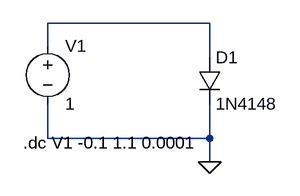
[diagram p0: schematic d1n4148_ref.asc]
d1n4148_ref.asc, the LTspice schematic file:
Version 4
SHEET 1 880 680
WIRE 256 48 32 48
WIRE 32 80 32 48
WIRE 256 96 256 48
WIRE 32 208 32 160
WIRE 256 208 256 160
WIRE 256 208 32 208
WIRE 256 240 256 208
FLAG 256 240 0
SYMBOL diode 240 96 R0
SYMATTR InstName D1
SYMATTR Value 1N4148
SYMBOL voltage 32 64 R0
SYMATTR InstName V1
SYMATTR Value 1
TEXT -2 214 Left 2 !.dc V1 -0.1 1.1 0.0001

The netlist it stands for:
* d1n4148_ref.asc
D1 N001 0 1N4148
V1 N001 0 1
.model D D
.lib standard.dio
.dc V1 -0.1 1.1 0.0001
.backanno
.end